# EAGLE design driver (EAGLE 5.10)
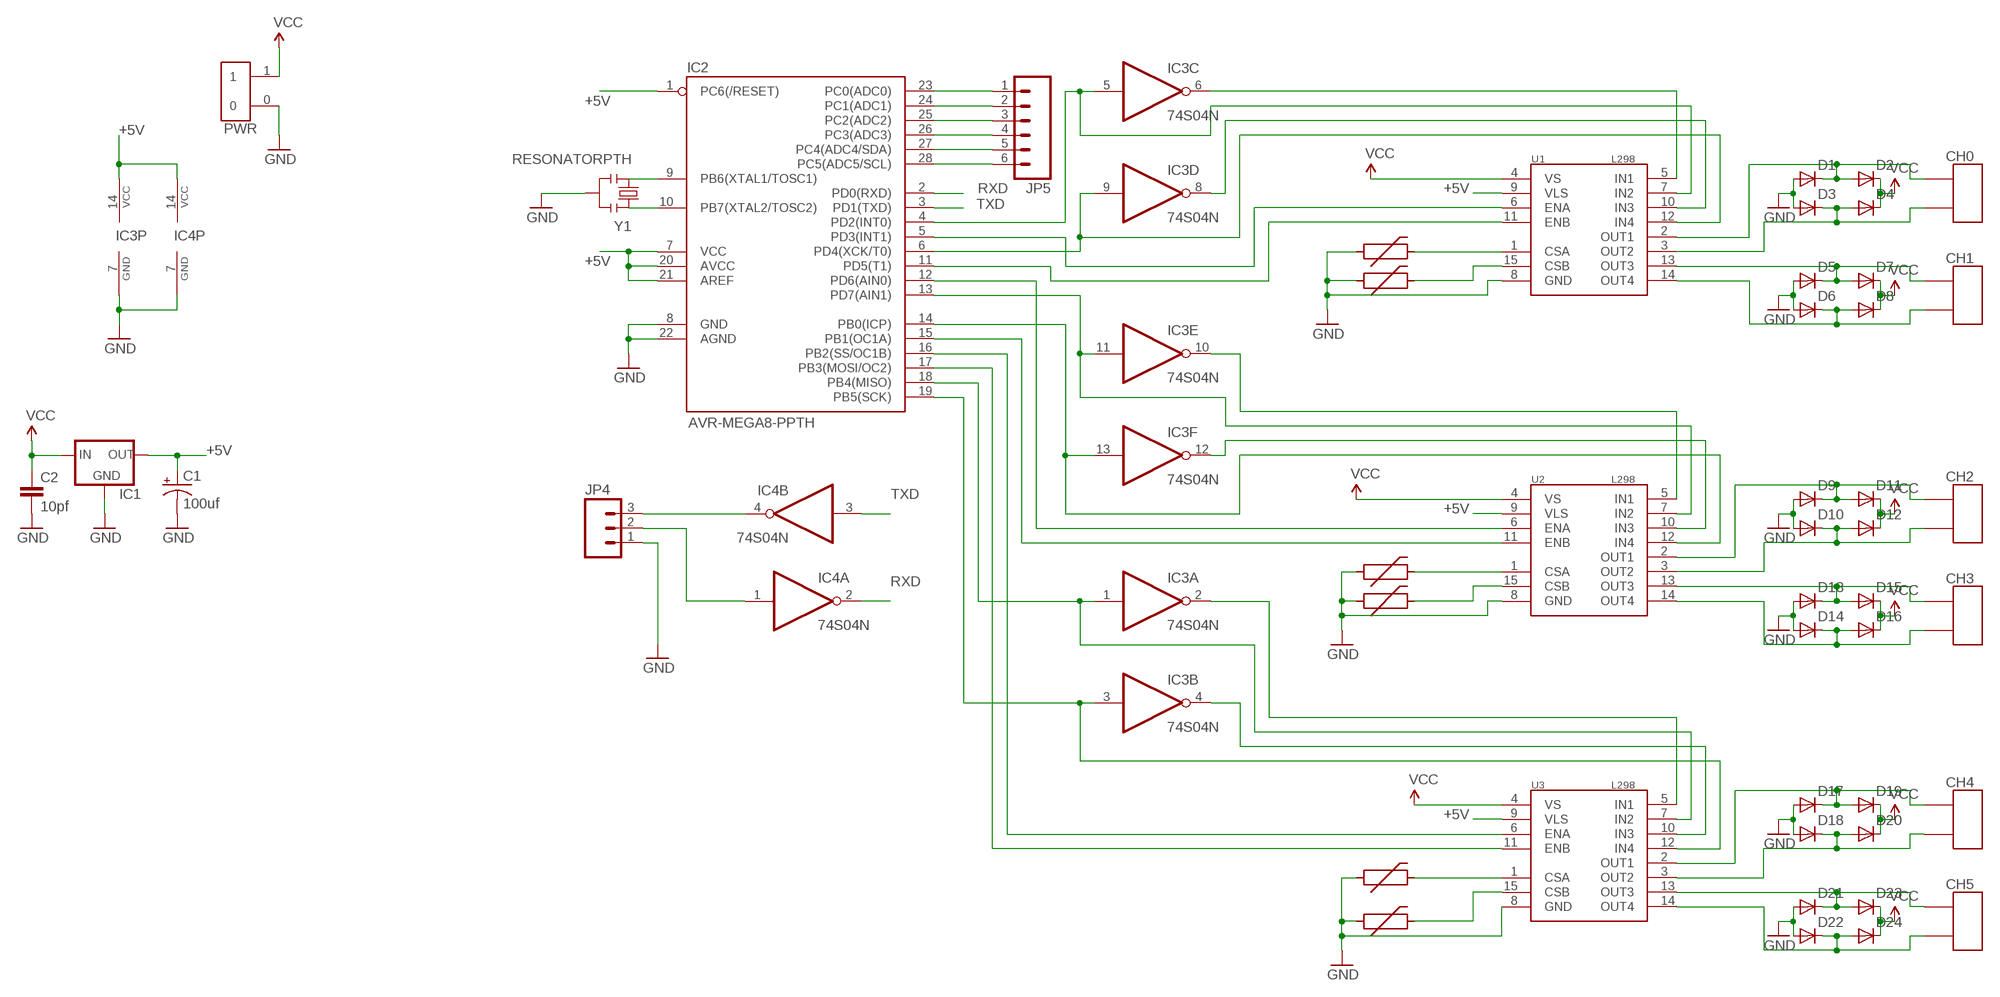
[diagram p0: schematic, sheet 1]

## Parts
C1  100uf  CAP_POLPTH1  [CPOL-RADIAL-100UF-25V]
C2  10pf  CAPPTH2  [CAP-PTH-SMALL2]
CH0  OSTTC022162C022  [OST]
CH1  OSTTC022162C022  [OST]
CH2  OSTTC022162C022  [OST]
CH3  OSTTC022162C022  [OST]
CH4  OSTTC022162C022  [OST]
CH5  OSTTC022162C022  [OST]
D1  DIODE_DO-41  [DO-41]
D2  DIODE_DO-41  [DO-41]
D3  DIODE_DO-41  [DO-41]
D4  DIODE_DO-41  [DO-41]
D5  DIODE_DO-41  [DO-41]
D6  DIODE_DO-41  [DO-41]
D7  DIODE_DO-41  [DO-41]
D8  DIODE_DO-41  [DO-41]
D9  DIODE_DO-41  [DO-41]
D10  DIODE_DO-41  [DO-41]
D11  DIODE_DO-41  [DO-41]
D12  DIODE_DO-41  [DO-41]
D13  DIODE_DO-41  [DO-41]
D14  DIODE_DO-41  [DO-41]
D15  DIODE_DO-41  [DO-41]
D16  DIODE_DO-41  [DO-41]
D17  DIODE_DO-41  [DO-41]
D18  DIODE_DO-41  [DO-41]
D19  DIODE_DO-41  [DO-41]
D20  DIODE_DO-41  [DO-41]
D21  DIODE_DO-41  [DO-41]
D22  DIODE_DO-41  [DO-41]
D23  DIODE_DO-41  [DO-41]
D24  DIODE_DO-41  [DO-41]
F1  PTC_RESETTABLE_LITTELFUSE1812L110DEFAULT  [LITTELFUSE_1812L]
F2  PTC_RESETTABLE_LITTELFUSE1812L110DEFAULT  [LITTELFUSE_1812L]
F3  PTC_RESETTABLE_LITTELFUSE1812L110DEFAULT  [LITTELFUSE_1812L]
F4  PTC_RESETTABLE_LITTELFUSE1812L110DEFAULT  [LITTELFUSE_1812L]
F5  PTC_RESETTABLE_LITTELFUSE1812L110DEFAULT  [LITTELFUSE_1812L]
F6  PTC_RESETTABLE_LITTELFUSE1812L110DEFAULT  [LITTELFUSE_1812L]
IC1  V_REG_78XXSINK  [TO220-IGO]
IC2  AVR-MEGA8-PPTH  [DIL28-3]
IC3  74S04N  [DIL14]
IC4  74S04N  [DIL14]
JP4  M03PTH  [1X03]
JP5  M06SIP  [1X06]
PWR  OSTTC022162C022  [OST]
U1  L298  [MULTIWATT15]
U2  L298  [MULTIWATT15]
U3  L298  [MULTIWATT15]
Y1  RESONATORPTH  [RESONATOR-PTH]

## Nets
+5V: C1.1(+) IC1.OUT IC2.1(PC6(/RESET)) IC2.7(VCC) IC2.20(AVCC) IC2.21(AREF) IC3.14(P:VCC) IC4.14(P:VCC) U1.9(VLS) U2.9(VLS) U3.9(VLS)
ADC0: IC2.23(PC0(ADC0)) JP5.1
ADC1: IC2.24(PC1(ADC1)) JP5.2
ADC2: IC2.25(PC2(ADC2)) JP5.3
ADC3: IC2.26(PC3(ADC3)) JP5.4
ADC4: IC2.27(PC4(ADC4/SDA)) JP5.5
ADC5: IC2.28(PC5(ADC5/SCL)) JP5.6
CH0_EN: IC2.5(PD3(INT1)) U1.6(ENA)
CH0_GND: F1.2 U1.1(CSA)
CH0_OUTA: CH0.0 D1.0 D2.1 U1.2(OUT1)
CH0_OUTB: CH0.1 D3.0 D4.1 U1.3(OUT2)
CH0_PHASE: IC2.4(PD2(INT0)) IC3.5(C:I) U1.7(IN2)
CH0_PHASE_INVERTED: IC3.6(C:O) U1.5(IN1)
CH1_EN: IC2.11(PD5(T1)) U1.11(ENB)
CH1_GND: F3.2 U1.15(CSB)
CH1_OUTA: CH1.0 D5.0 D7.1 U1.13(OUT3)
CH1_OUTB: CH1.1 D6.0 D8.1 U1.14(OUT4)
CH1_PHASE: IC2.6(PD4(XCK/T0)) IC3.9(D:I) U1.12(IN4)
CH1_PHASE_INVERTED: IC3.8(D:O) U1.10(IN3)
CH2_EN: IC2.12(PD6(AIN0)) U2.6(ENA)
CH2_GND: F2.2 U2.1(CSA)
CH2_OUTA: CH2.0 D9.0 D11.1 U2.2(OUT1)
CH2_OUTB: CH2.1 D10.0 D12.1 U2.3(OUT2)
CH2_PHASE: IC2.13(PD7(AIN1)) IC3.11(E:I) U2.7(IN2)
CH2_PHASE_INVERTED: IC3.10(E:O) U2.5(IN1)
CH3_EN: IC2.15(PB1(OC1A)) U2.11(ENB)
CH3_GND: F4.2 U2.15(CSB)
CH3_OUTA: CH3.0 D13.0 D15.1 U2.13(OUT3)
CH3_OUTB: CH3.1 D14.0 D16.1 U2.14(OUT4)
CH3_PHASE: IC2.14(PB0(ICP)) IC3.13(F:I) U2.12(IN4)
CH3_PHASE_INVERTED: IC3.12(F:O) U2.10(IN3)
CH4_EN: IC2.16(PB2(SS/OC1B)) U3.6(ENA)
CH4_GND: F6.2 U3.1(CSA)
CH4_OUTA: CH4.0 D17.0 D19.1 U3.2(OUT1)
CH4_OUTB: CH4.1 D18.0 D20.1 U3.3(OUT2)
CH4_PHASE: IC2.18(PB4(MISO)) IC3.1(A:I) U3.7(IN2)
CH4_PHASE_INVERTED: IC3.2(A:O) U3.5(IN1)
CH5_EN: IC2.17(PB3(MOSI/OC2)) U3.11(ENB)
CH5_GND: F5.2 U3.15(CSB)
CH5_OUTA: CH5.0 D21.0 D23.1 U3.13(OUT3)
CH5_OUTB: CH5.1 D22.0 D24.1 U3.14(OUT4)
CH5_PHASE: IC2.19(PB5(SCK)) IC3.3(B:I) U3.12(IN4)
CH5_PHASE_INVERTED: IC3.4(B:O) U3.10(IN3)
GND: C1.2(-) C2.2 D1.1 D3.1 D5.1 D6.1 D9.1 D10.1 D13.1 D14.1 D17.1 D18.1 D21.1 D22.1 F1.1 F2.1 F3.1 F4.1 F5.1 F6.1 IC1.GND IC2.8(GND) IC2.22(AGND) IC3.7(P:GND) IC4.7(P:GND) JP4.1 PWR.0 U1.8(GND) U2.8(GND) U3.8(GND) Y1.2
RX_IN: IC4.1(A:I) JP4.2
RXD: IC2.2(PD0(RXD)) IC4.2(A:O)
TX_OUT: IC4.4(B:O) JP4.3
TXD: IC2.3(PD1(TXD)) IC4.3(B:I)
VCC: C2.1 D2.0 D4.0 D7.0 D8.0 D11.0 D12.0 D15.0 D16.0 D19.0 D20.0 D23.0 D24.0 IC1.IN PWR.1 U1.4(VS) U2.4(VS) U3.4(VS)
XTAL1: IC2.9(PB6(XTAL1/TOSC1)) Y1.1
XTAL2: IC2.10(PB7(XTAL2/TOSC2)) Y1.3
Unconnected: IC4.5(C:I) IC4.6(C:O) IC4.8(D:O) IC4.9(D:I) IC4.10(E:O) IC4.11(E:I) IC4.12(F:O) IC4.13(F:I)

## Library data of the parts
C1 = SparkFun:CAP_POL: Capacitor Polarized These are standard SMD and PTH capacitors. Normally 10uF, 47uF, and 100uF in electrolytic and tantalum varieties. Always verify the external diameter of the through hole cap, it varies with capacity, voltage, and manufacturer. The EIA devices should be standard.
C2 = SparkFun:CAP: Capacitor Standard 0603 ceramic capacitor, and 0.1" leaded capacitor.
CH0 CH1-CH5 = walthour:OSTTC022162
D1-D24 = walthour:DIODE: A DO-41 packaged diode
F1-F6 = walthour:PTC_RESETTABLE_LITTELFUSE1812L110: A PTC resettable fuse. Fuse resets when voltage is removed.
IC1 = SparkFun:V_REG_78XX: Voltage Regulator Standard 7805 5V regulator. IGO (Input Ground Output). Spark Fun Electronics SKU : COM-00107
IC2 = SparkFun:AVR-MEGA8-P: MICROCONTROLLER 8 Kbytes FLASH 1 kbytes SRAM 512 bytes EEPROM USART 4-channel 10 bit ADC 2-channel 8 bit ADC
IC3 IC4 = 74xx-us:74*04: Hex INVERTER
JP4 = SparkFun:M03: Header 3 Standard 3-pin 0.1" header. Use with straight break away headers (SKU : PRT-00116), right angle break away headers (PRT-00553), swiss pins (PRT-00743), machine pins (PRT-00117), and female headers (PRT-00115). Molex polarized connector foot print use with SKU : PRT-08232 with associated crimp pins and housings.
JP5 = SparkFun:M06: Header 6 Standard 6-pin 0.1" header. Use with straight break away headers (SKU : PRT-00116), right angle break away headers (PRT-00553), swiss pins (PRT-00743), machine pins (PRT-00117), and female headers (PRT-00115). Molex polarized connector foot print use with SKU : PRT-08094 with associated crimp pins and housings. NOTES ON THE VARIANTS LOCK and LOCK_LONGPADS... This footprint was designed to help hold the alignment of a through-hole component (i.e. 6-pin header) while soldering it into place. You may notice that each hole has been shifted either up or down by 0.005 of an inch from it's more standard position (which is a perfectly straight line). This slight alteration caused the pins (the squares in the middle) to touch the edges of the holes. Because they are alternating, it causes a "brace" to hold the component in place. 0.005 has proven to be the perfect amount of "off-center" position when using our standard breakaway headers. Although looks a little odd when you look at the bare footprint, once you have a header in there, the alteration is very hard to notice. Also, if you push a header all the way into place, it is covered up entirely on the bottom side. This idea of altering the position of holes to aid alignment will be further integrated into the Sparkfun Library for other footprints. It can help hold any component with 3 or more connection pins.
PWR = connectors:OSTTC022162
U1-U3 = SparkFun:L298: L298 Dual Full Bridge Driver
Y1 = SparkFun:RESONATOR: Resonator Small SMD resonator. This is the itty bitty 10/20MHz resonators with built in caps. CSTCE10M0G55 and CSTCE20M0V53. Footprint has been reviewed closely but hasn't been tested yet.

## Board
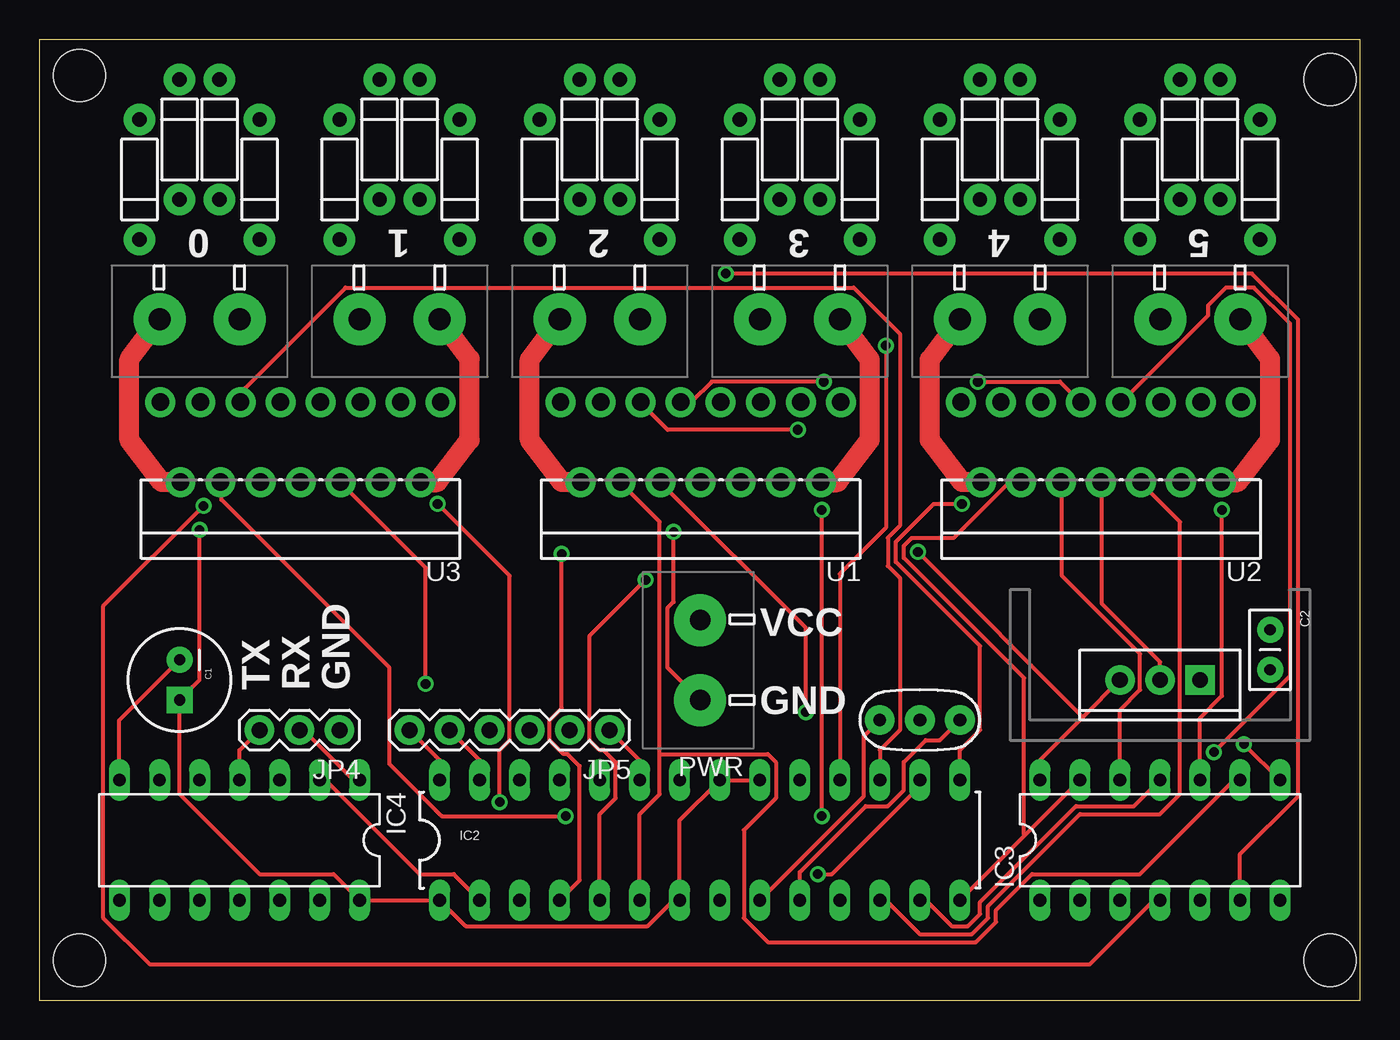
[diagram p1: board, top side]
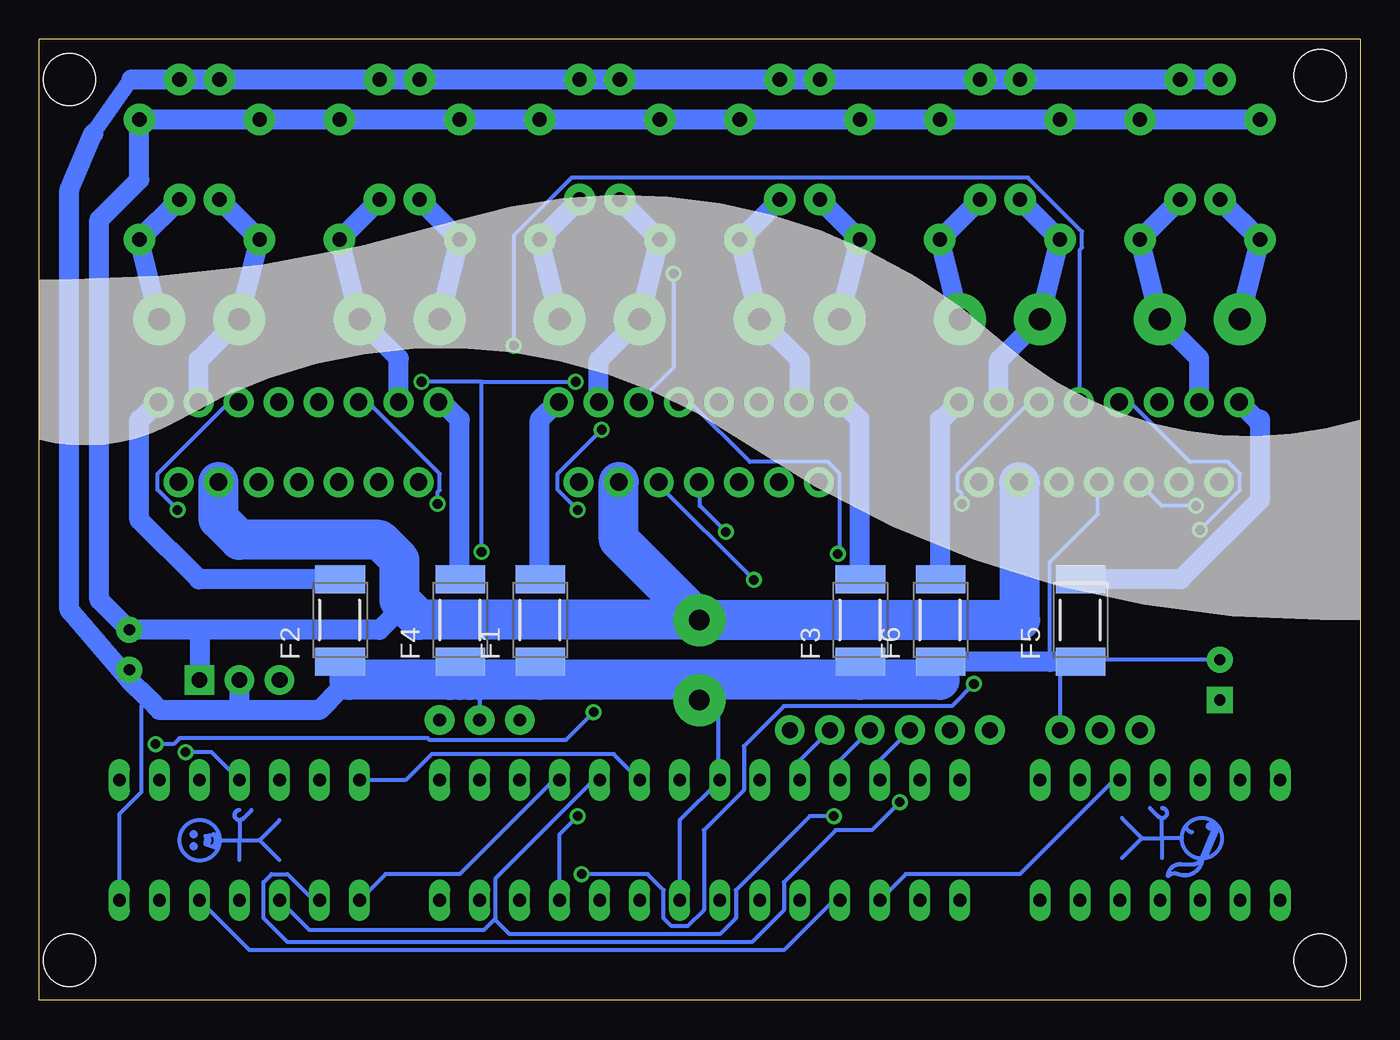
[diagram p2: board, bottom side, seen from below]

Size 83.82 x 60.96 mm. Coordinates in mm from the lower left corner, seen from the top.
Outline: 83.82,0 83.82,60.96 0,60.96 0,0 83.82,0
Copper layers (1*16): Top 0.035mm / dielectric 1.5mm / Bottom 0.035mm
Design rules "default": minimum track width 10mil, minimum drill 24mil, track to track 8mil, track to pad 8mil, pad to pad 8mil, via to via 8mil, smd to smd 8mil, copper to edge 40mil, drill to drill 8mil, minimum pad ring 10mil, minimum via ring 8mil, stop-mask expansion 4mil, vias tented up to drill 0mil, thermal gap 10mil
Holes 3.3 mm at 2.54,58.67 2.54,2.54 81.92,58.42 81.92,2.54

### Footprints (pad centres in the part's own frame; a part is rotated, then mirrored left to right if it is on the bottom)
CPOL-RADIAL-100UF-25V = drill 0.7 pad 1.651 square: 1 1.27,0 | drill 0.7 pad 1.651 round: 2 -1.27,0
CAP-PTH-SMALL2 = drill 0.7 pad 1.651 round: 1 0,0; 2 2.54,0
OST = drill 1.397 pad 3.302 round: 0 -0.029,2.548; 1 -0.029,-2.532
DO-41 = drill 0.9 pad 2 round: 0 -3.81,0; 1 3.81,0
LITTELFUSE_1812L = smd 3.15 x 1.78: 1 0.04,-2.66; 2 0.04,2.57
TO220-IGO = drill 1 pad 1.88 round: GND 0,0; OUT 2.54,0 | drill 1 pad 1.88 square: IN -2.54,0
DIL28-3 = drill 0.813 long: 1 -16.51,-3.81; 2 -13.97,-3.81; 3 -11.43,-3.81; 4 -8.89,-3.81; 5 -6.35,-3.81; 6 -3.81,-3.81; 7 -1.27,-3.81; 8 1.27,-3.81; 9 3.81,-3.81; 10 6.35,-3.81; 11 8.89,-3.81; 12 11.43,-3.81; 13 13.97,-3.81; 14 16.51,-3.81; 15 16.51,3.81; 16 13.97,3.81; 17 11.43,3.81; 18 8.89,3.81; 19 6.35,3.81; 20 3.81,3.81; 21 1.27,3.81; 22 -1.27,3.81; 23 -3.81,3.81; 24 -6.35,3.81; 25 -8.89,3.81; 26 -11.43,3.81; 27 -13.97,3.81; 28 -16.51,3.81
DIL14 = drill 0.813 long: 1 -7.62,-3.81; 2 -5.08,-3.81; 3 -2.54,-3.81; 4 0,-3.81; 5 2.54,-3.81; 6 5.08,-3.81; 7 7.62,-3.81; 8 7.62,3.81; 9 5.08,3.81; 10 2.54,3.81; 11 0,3.81; 12 -2.54,3.81; 13 -5.08,3.81; 14 -7.62,3.81
1X03 = drill 1.016 pad 1.88 round: 1 0,0; 2 2.54,0; 3 5.08,0
1X06 = drill 1.016 pad 1.88 round: 1 0,0; 2 2.54,0; 3 5.08,0; 4 7.62,0; 5 10.16,0; 6 12.7,0
OST' = drill 1.3 pad 3.3 round: 0 -0.029,2.548; 1 -0.029,-2.532
MULTIWATT15 = drill 1.1 pad 1.9 round: 1 -8.95,-2.39; 2 -7.68,2.69; 3 -6.41,-2.39; 4 -5.14,2.69; 5 -3.87,-2.39; 6 -2.6,2.69; 7 -1.33,-2.39; 8 -0.06,2.69; 9 1.21,-2.39; 10 2.48,2.69; 11 3.75,-2.39; 12 5.02,2.69; 13 6.29,-2.39; 14 7.56,2.69; 15 8.83,-2.39
RESONATOR-PTH = drill 0.8 pad 1.88 round: 1 -2.54,0; 2 0,0; 3 2.54,0

### Placement (x,y rotation side)
C1  8.89,20.32 270 top
C2  78.11,23.5 270 top
CH0  48.26,43.18 270 top
CH1  35.56,43.18 270 top
CH2  73.66,43.18 270 top
CH3  60.96,43.18 270 top
CH4  22.86,43.18 270 top
CH5  10.16,43.18 270 top
D1  49.53,54.61 90 top
D2  52.07,52.07 270 top
D3  46.99,54.61 90 top
D4  44.45,52.07 270 top
D5  36.83,54.61 90 top
D6  34.29,54.61 90 top
D7  39.37,52.07 270 top
D8  31.75,52.07 270 top
D9  74.93,54.61 90 top
D10  72.39,54.61 90 top
D11  77.47,52.07 270 top
D12  69.85,52.07 270 top
D13  62.23,54.61 90 top
D14  59.69,54.61 90 top
D15  64.77,52.07 270 top
D16  57.15,52.07 270 top
D17  24.13,54.61 90 top
D18  21.59,54.61 90 top
D19  26.67,52.07 270 top
D20  19.05,52.07 270 top
D21  11.43,54.61 90 top
D22  8.89,54.61 90 top
D23  13.97,52.07 270 top
D24  6.35,52.07 270 top
F1  52.07,24.13 0 bottom
F2  64.77,24.13 0 bottom
F3  31.75,24.13 0 bottom
F4  57.15,24.13 0 bottom
F5  17.78,24.13 0 bottom
F6  26.67,24.13 0 bottom
IC1  71.12,20.32 180 top
IC2  41.91,10.16 0 top
IC3  71.12,10.16 0 top
IC4  12.7,10.16 180 top
JP4  19.05,17.14 180 top
JP5  36.2,17.14 180 top
PWR  OSTTC022162C022  [OST']  41.91,21.59 180 top
U1  41.91,35.56 180 top
U2  67.31,35.56 180 top
U3  16.51,35.56 180 top
U$1  [EW_COPPER]  12.57,10.29 90 top
U$2  [JW_COPPER]  71.12,10.16 270 top
Y1  55.88,17.78 0 top

### Tracks (layer width: path | path; a pad name or v marks a point on that pad's centre or on a via)
+5V  (via drill 0.61)
  Top 0.254: v49.78,39.24 42.67,39.24 41.4,37.97 40.77,37.97 U1.9 | v59.56,39.24 64.77,39.24 66.04,37.97 U2.9 | IC3.14 63.5,15.24 66.23,17.97 | 66.23,17.97 IC1.OUT | IC2.20 IC2.21 40.64,11.43 IC2.7 40.26,6.35 38.61,4.7 27.05,4.7 IC2.1 IC4.14 18.67,8 13.97,8 8.89,13.08 C1.1 10.16,20.32 v10.16,29.84 | 66.23,17.97 v55.75,28.45
  Bottom 0.254: 55.75,39.24 v59.56,39.24 | 55.75,39.24 v49.78,39.24 | v10.16,29.84 7.62,32.38 7.62,33.4 8.38,34.16 10.79,34.16 14.48,37.85 15.24,37.85 U3.9 | IC3.14 60.58,13.97 58.93,15.62 47.37,15.62 IC2.20 | v55.75,28.45 55.75,39.24
ADC0
  Top 0.254: IC2.23 38.1,15.24 JP5.1
ADC1
  Bottom 0.254: IC2.24 35.56,15.24 JP5.2
ADC2
  Bottom 0.254: IC2.25 33.02,15.24 JP5.3
ADC3
  Bottom 0.254: IC2.26 30.48,15.24 JP5.4
ADC4
  Top 0.254: IC2.27 27.94,15.24 JP5.5
ADC5
  Top 0.254: IC2.28 25.4,15.24 JP5.6
CH0_EN  (via drill 0.61)
  Top 0.254: IC2.5 35.56,11.81 36.58,12.83 36.58,15.11 35.81,15.88 35.56,15.88 34.92,16.51 34.92,23.11 v38.48,26.67
  Bottom 0.254: v38.48,26.67 44.58,32.77 U1.6
CH0_GND
  Bottom 1.27: U1.1 50.95,37.95 52.07,36.83 52.07,26.74 F1.2
CH0_OUTA
  Top 0.254: 50.85,43.12 50.93,43.18 CH0.0
  Top 1.27: U1.2 50.65,32.87 52.7,35.56 52.7,40.64 50.85,43.12 50.8,43.18
  Bottom 1.27: D1.0 D2.1 CH0.0
CH0_OUTB
  Bottom 1.27: U1.3 48.32,40.62 CH0.1 D4.1 D3.0
CH0_PHASE  (via drill 0.61)
  Top 0.254: v33.15,28.32 33.15,18.54 32.38,17.78 32.38,16.51 33.27,15.62 33.53,15.62 34.29,14.86 34.29,7.62 IC2.4
  Bottom 0.254: IC2.4 33.4,6.35 36.58,3.17 70.48,3.17 IC3.5 | v33.15,28.32 33.02,28.45 33.02,33.4 33.78,34.16 38.73,34.16 42.42,37.85 43.18,37.85 U1.7
CH0_PHASE_INVERTED  (via drill 0.61)
  Top 0.254: IC3.6 76.2,9.27 79.88,12.95 79.88,43.18 76.96,46.1 v43.56,46.1
  Bottom 0.254: v43.56,46.1 43.56,40.13 45.72,37.97 U1.5
CH1_EN  (via drill 0.61)
  Top 0.254: v49.66,11.68 v49.66,31.11 | v48.13,36.2 39.88,36.2 38.23,37.85 U1.11
  Bottom 0.254: IC2.11 50.8,10.54 v49.66,11.68 | v49.66,31.11 50.93,32.38 50.93,33.4 v48.13,36.2
CH1_GND
  Bottom 1.27: U1.15 32.87,37.95 31.75,36.83 31.75,26.74 F3.2
CH1_OUTA
  Bottom 1.27: U1.13 35.56,38.01 35.56,40.64 38.11,43.19 CH1.0 D7.1 D5.0
CH1_OUTB
  Top 1.27: U1.14 33.17,32.87 31.11,35.56 31.11,40.64 33.02,43.18 CH1.1
  Bottom 1.27: CH1.1 D8.1 D6.0
CH1_PHASE
  Top 0.254: IC2.6 38.1,11.81 39.37,13.08 39.37,15.62 | 39.37,15.62 39.37,30.35 36.96,32.77 U1.12 | IC3.9 75.82,13.97 69.85,8 62.99,8 60.71,5.71 60.71,4.95 59.44,3.68 46.23,3.68 44.7,5.21 44.7,10.79 46.74,12.83 46.74,15.11 46.23,15.62 39.37,15.62
CH1_PHASE_INVERTED  (via drill 0.61)
  Top 0.254: v76.45,16.26 IC3.8 | v48.64,18.29 48.64,23.62 39.5,32.77 U1.10
  Bottom 0.254: v76.45,16.26 75.31,16.26 74.93,16.64 59.18,16.64 59.05,16.51 50.42,16.51 v48.64,18.29
CH2_EN
  Top 0.254: IC2.12 53.72,6.35 55.88,4.19 59.18,4.19 60.2,5.21 60.2,5.97 66.04,11.81 71.12,11.81 72.39,13.08 72.39,30.35 69.98,32.77 U2.6
CH2_GND
  Bottom 1.27: F2.2 73.69,26.7 77.47,30.48 77.47,36.83 77.38,36.83 U2.1
CH2_OUTA
  Top 1.27: U2.2 76.05,32.87 78.11,35.56 78.11,40.68 CH2.0
  Bottom 1.27: D9.0 D11.1 CH2.0
CH2_OUTB
  Bottom 1.27: U2.3 73.72,40.62 CH2.1 D12.1 D10.0
CH2_PHASE  (via drill 0.61)
  Top 0.254: IC2.13 56.26,6.35 57.91,4.7 58.93,4.7 59.69,5.46 59.69,6.22 65.79,12.32 69.47,12.32 IC3.11 | v74.55,15.75 79.38,20.57 79.38,42.93 77.09,45.21 75.31,45.21 74.17,44.07 74.17,43.43 68.71,37.97 U2.7
  Bottom 0.254: v74.55,15.75 72.9,15.75 IC3.11
CH2_PHASE_INVERTED  (via drill 0.61)
  Top 0.254: IC3.10 73.66,17.91 75.06,19.3 v75.06,31.11
  Bottom 0.254: v75.06,31.11 76.33,32.38 76.33,33.4 71.88,37.85 71.25,37.85 U2.5
CH3_EN  (via drill 0.61)
  Top 0.254: IC2.15 58.42,15.88 59.69,17.14 59.69,22.48 54.36,27.81 54.36,29.08 56.77,31.5 v58.55,31.5
  Bottom 0.254: v58.55,31.5 58.55,32.26 58.42,32.38 58.42,33.4 62.87,37.85 63.5,37.85 U2.11
CH3_GND
  Bottom 1.27: U2.15 58.27,37.95 57.15,36.83 57.15,26.74 F4.2
CH3_OUTA
  Bottom 1.27: U2.13 61.02,40.72 CH3.0 D15.1 D13.0
CH3_OUTB
  Top 1.27: U2.14 58.57,32.87 56.52,35.56 56.52,40.64 58.42,43.18 CH3.1
  Bottom 1.27: CH3.1 D16.1 D14.0
CH3_PHASE
  Top 0.254: 62.55,10.48 IC3.13 | IC2.14 62.55,10.48 | U2.12 62.23,32.77 61.47,32.77 58.04,29.34 55.37,29.34 54.86,28.83 54.86,28.07 62.48,20.45 62.48,10.54 62.55,10.48
CH3_PHASE_INVERTED
  Top 0.254: IC3.12 68.58,18.41 69.85,19.68 69.85,21.97 64.9,26.92 64.9,32.77 U2.10
CH4_EN  (via drill 0.61)
  Top 0.254: IC2.16 55.88,13.59 50.29,8 v49.4,8 | v24.51,20.07 24.51,27.43 19.18,32.77 U3.6
  Bottom 0.254: v49.4,8 45.21,8 44.2,6.99 44.2,5.21 43.69,4.7 42.67,4.7 41.66,5.71 41.66,10.79 39.12,13.34 39.12,16.13 36.58,18.67 25.91,18.67 v24.51,20.07
CH4_GND
  Bottom 1.27: F6.2 26.63,36.79 26.67,36.83 26.58,36.83 U3.1
CH4_OUTA
  Top 1.27: U3.2 25.25,32.87 27.3,35.56 27.3,40.68 CH4.0
  Bottom 1.27: D17.0 D19.1 CH4.0
CH4_OUTB
  Bottom 1.27: U3.3 22.92,40.62 CH4.1 D20.1 D18.0
CH4_PHASE  (via drill 0.61)
  Top 0.254: v53.72,41.53 53.72,29.97 50.8,27.05 IC2.18
  Bottom 0.254: IC2.18 51.18,13.97 57.15,8 61.85,8 IC3.1 | v53.72,41.53 53.72,48.51 50.04,52.2 21.08,52.2 17.65,48.77 17.65,47.75 17.78,47.62 17.78,37.97 U3.7
CH4_PHASE_INVERTED  (via drill 0.61)
  Top 0.254: v29.21,12.57 29.21,15.88 29.84,16.51 29.84,26.92 v25.27,31.5
  Bottom 0.254: IC3.2 66.42,6.35 68.07,8 69.09,8 69.6,7.49 69.6,5.21 68.07,3.68 38.61,3.68 36.58,5.71 36.58,7.49 33.27,10.79 30.99,10.79 v29.21,12.57 | v25.27,31.5 25.27,32.13 25.53,32.38 25.53,33.4 21.08,37.85 20.45,37.85 U3.5
CH5_EN
  Top 0.254: IC2.17 53.34,15.88 54.61,17.14 54.61,26.8 53.85,27.56 53.85,29.34 54.61,30.1 54.61,42.29 51.69,45.21 19.43,45.21 12.83,38.61 12.83,37.97 U3.11
CH5_GND
  Bottom 1.27: F5.2 11.4,26.7 6.35,31.75 6.35,36.83 6.56,36.83 U3.15
CH5_OUTA
  Bottom 1.27: U3.13 10.22,40.72 CH5.0 D23.1 D21.0
CH5_OUTB
  Top 1.27: U3.14 7.77,32.87 5.71,35.56 5.71,40.66 CH5.1
  Bottom 1.27: CH5.1 D24.1 D22.0
CH5_PHASE  (via drill 0.61)
  Top 0.254: v33.4,11.68 25.53,11.68 22.23,14.99 22.23,21.08 11.56,31.75 11.56,32.77 U3.12
  Bottom 0.254: IC2.19 48.64,13.97 54.86,7.75 54.86,5.21 54.93,5.14 | 54.93,5.14 55.63,4.45 66.67,4.45 IC3.3 | v33.4,11.68 34.92,11.68 39.62,6.99 39.62,5.21 40.64,4.19 53.98,4.19 54.93,5.14
CH5_PHASE_INVERTED  (via drill 0.61)
  Top 0.254: IC3.4 70.74,6.35 66.67,2.29 6.99,2.29 4.06,5.21 4.06,25.02 v10.41,31.37
  Bottom 0.254: v10.41,31.37 12.57,31.37 13.97,32.77 U3.10
GND  (via drill 0.61)
  Top 0.254: IC4.7 5.08,17.78 C1.2 | v40.26,29.72 40.26,25.27 39.88,24.89 39.88,21.08 41.91,19.05 PWR.0 | IC1.GND 71.12,21.46 67.44,25.15 67.44,32.77 U2.8
  Bottom 0.254: IC2.8 43.18,11.43 IC2.22 40.77,13.97 40.77,18.67 PWR.0 | IC3.7 78.74,11.81 77.34,13.21 77.34,18.67 76.9,19.11 | JP4.1 19.05,20.95 F5.1 17.14,21.59 C1.2 | 55.88,20.32 Y1.2 | U3.8 16.64,32.77 16.64,30.86 19.68,27.81 19.68,21.47 | v40.26,29.72 41.91,31.37 41.91,32.77 U1.8
  Bottom 1.016: 80.39,54.99 77.98,58.42
  Bottom 1.27: 26.67,20.32 26.67,21.43 F6.1 19.68,21.47 F5.1 | F3.1 31.71,20.36 31.75,20.32 | 52.07,20.32 52.07,21.43 F1.1 | D22.1 D21.1 D18.1 D17.1 D6.1 D5.1 D3.1 D1.1 D14.1 D13.1 D10.1 D9.1 77.98,58.42 | F4.1 57.11,20.36 57.15,20.32 | 56.52,20.32 57.78,20.32 | 64.14,20.32 64.14,20.88 F2.1 64.73,19.73 66.04,18.41 71.12,18.41 | 71.12,18.41 IC1.GND | 78.11,20.32 C2.2 | 78.11,20.32 76.9,19.11 76.2,18.41 71.12,18.41 | 78.11,20.32 81.92,24.77 81.92,51.44 80.39,54.99
  Bottom 2.54: 26.67,20.32 31.75,20.32 41.91,20.32 | PWR.0 41.94,20.29 41.91,20.32 | 41.91,20.32 52.07,20.32 55.88,20.32 56.52,20.32 57.15,20.32 57.78,20.32 64.14,20.32
RX_IN
  Top 0.254: IC4.1 19.94,13.97 16.76,17.14 JP4.2
RXD
  Top 0.254: IC4.2 18.16,13.97 24.13,8 26.29,8 IC2.2
TX_OUT
  Top 0.254: IC4.4 12.7,15.88 JP4.3
TXD
  Bottom 0.254: IC4.3 15.62,13.97 21.59,8 28.83,8 IC2.3
VCC
  Bottom 1.27: D24.0 D23.0 D20.0 D19.0 D8.0 D7.0 D4.0 D2.0 D16.0 D15.0 D12.0 D11.0 77.47,52.07 80.01,49.53 80.01,25.4 C2.1 73.66,23.5 | 73.66,23.5 IC1.IN | 73.66,23.5 62.23,23.5 60.64,25.08
  Bottom 2.54: PWR.1 21.6,24.12 21.59,24.13 21.59,32.81 U3.4 | U1.4 47.05,29.23 PWR.1 | U2.4 72.45,30.54 71.12,29.21 62.23,29.21 60.96,27.94 60.96,25.4 60.64,25.08 59.69,24.13 PWR.1
XTAL1
  Top 0.254: IC2.9 52.32,12.95 52.32,16.76 Y1.1
XTAL2
  Top 0.254: IC2.10 48.26,8.13 52.45,12.32 53.85,12.32 54.86,13.34 54.86,15.11 56.26,16.51 57.15,16.51 Y1.3

### Text on the board
tPlace: 0 | 1 | 2 | 3 | 4 | 5 | VCC | TX | RX | GND | GND